# EAGLE schematic sensorBoard (EAGLE 9.4.2)
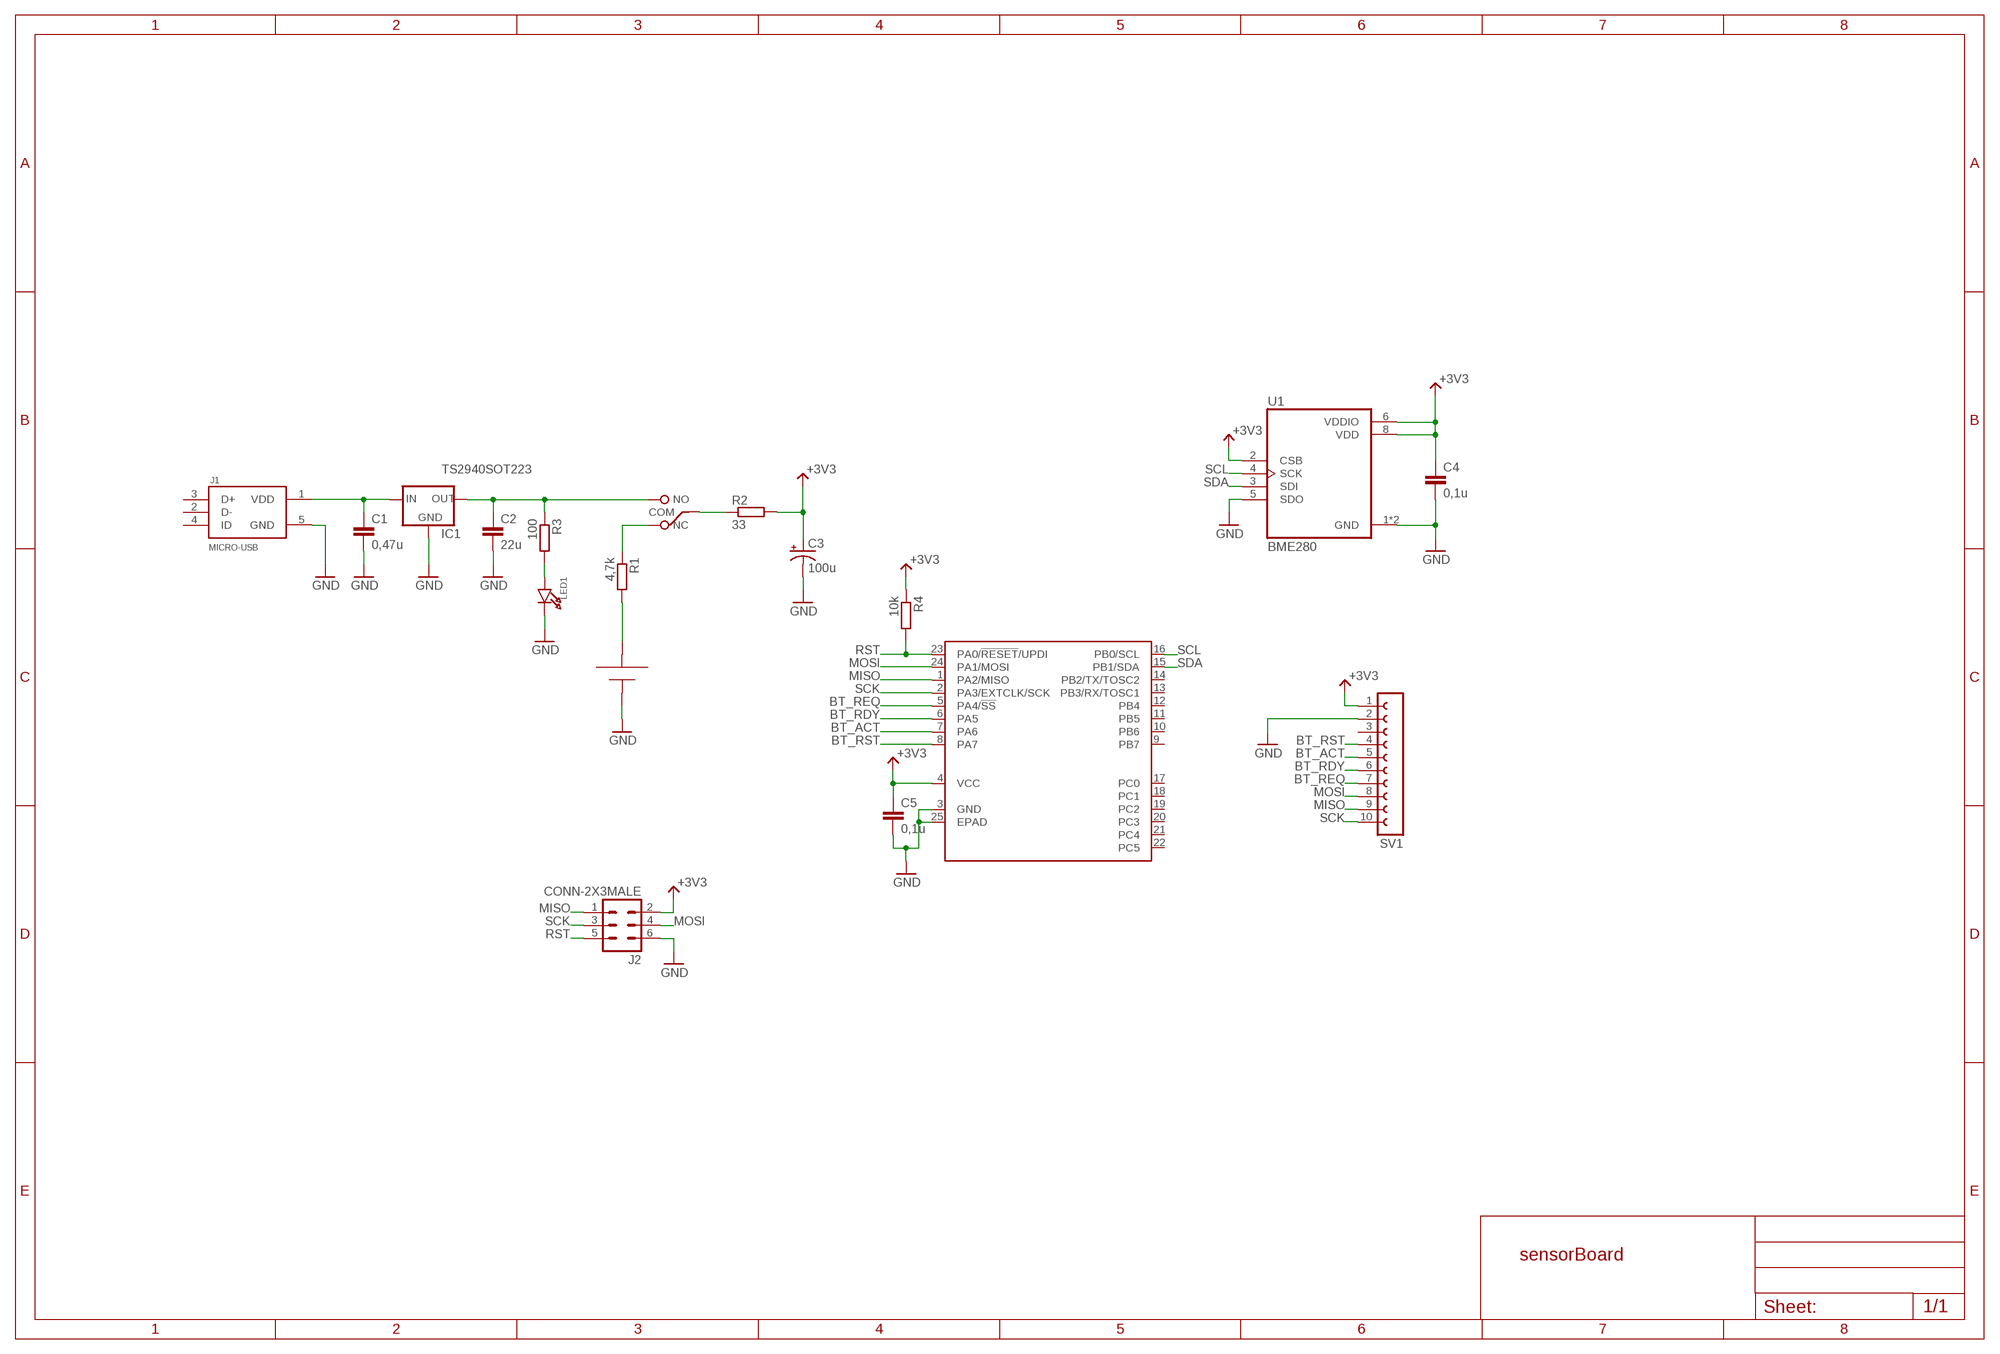
[diagram p0: schematic, sheet 1]

## Parts
C1  0,47u  SMD-CAPACITORC0805  [C0805K]
C2  22u  SMD-CAPACITORC0805  [C0805K]
C3  100u  SMD-ELECTROLYTIC-CAPACITORD8  [CAPAE660X800]
C4  0,1u  SMD-CAPACITORC0805  [C0805K]
C5  0,1u  SMD-CAPACITORC0805  [C0805K]
IC1  TS2940SOT223  [SOT230P700X180-4]
J1  MICRO-USB  [MOLEX_105017-0001]
J2  CONN-2X3MALE  [HDRV6W64P254_2X3_762X508X838B]
LED1  LED0805  [LED0805]
R1  4,7k  SMD-RESISTORR0805  [R0805]
R2  33  SMD-RESISTORR0805  [R0805]
R3  100  SMD-RESISTORR0805  [R0805]
R4  10k  SMD-RESISTORR0805  [R0805]
SV1  FE10-1  [FE10]
SW1  SWITCH  [EG1215AA]
U1  BME280  [PSON65P250X250X100-8N]
U$1  ATTINY3217TQFN-24  [QFN50P400X400X80-25T270]
U$3  CR24773039  [CR2477]

## Nets
+3V3: C3.1(+) C4.1 C5.1 J2.2 R2.2 R4.1 SV1.1 U1.2(CSB) U1.6(VDDIO) U1.8(VDD) U$1.4(VCC)
BT_ACT: SV1.5 U$1.7(PA6)
BT_RDY: SV1.6 U$1.6(PA5)
BT_REQ: SV1.7 U$1.5(PA4/!SS!)
BT_RST: SV1.4 U$1.8(PA7)
GND: C1.2 C2.2 C4.2 C5.2 IC1.2(GND) IC1.4(GND) J1.5(GND) J2.6 LED1.K(C) SV1.2 U1.1(GND) U1.5(SDO) U1.7(GND) U$1.3(GND) U$1.25(EPAD) U$3.P$3(N)
MISO: J2.1 SV1.9 U$1.1(PA2/MISO)
MOSI: J2.4 SV1.8 U$1.24(PA1/MOSI)
N$1: R1.1 SW1.1(NC)
N$2: C1.1 IC1.1(IN) J1.1(VDD)
N$3: C2.1 IC1.3(OUT) R3.1 SW1.3(NO)
N$4: R1.2 U$3.P$1(P) U$3.P$2(P)
N$5: R2.1 SW1.2(COM)
N$7: C3.2(-) ; supply symbol labelled GND
N$8: LED1.A R3.2
RST: J2.5 R4.2 U$1.23(PA0/!RESET!/UPDI)
SCK: J2.3 SV1.10 U$1.2(PA3/EXTCLK/SCK)
SCL: U1.4(SCK) U$1.16(PB0/SCL)
SDA: U1.3(SDI) U$1.15(PB1/SDA)
Unconnected: J1.2(D-) J1.3(D+) J1.4(ID) SV1.3 U$1.9(PB7) U$1.10(PB6) U$1.11(PB5) U$1.12(PB4) U$1.13(PB3/RX/TOSC1) U$1.14(PB2/TX/TOSC2) U$1.17(PC0) U$1.18(PC1) U$1.19(PC2) U$1.20(PC3) U$1.21(PC4) U$1.22(PC5)

## Library data of the parts
C1 C2 C4 C5 = PDI_PassiveComponents:SMD-CAPACITOR: SMD CAPACITORS: 0603, 0805, 1206
C3 = PDI_PassiveComponents:SMD-ELECTROLYTIC-CAPACITOR
IC1 = PDI_Semiconductors:TS2940
J1 = PDI_Connectors:MICRO-USB; AVAILABILITY: Available; DESCRIPTION: Conn USB Type B M 5 POS 0.65mm Solder RA Thru-Hole 5 Terminal 1 Port Embossed T/R; MF: Molex; MOUSER: https://www.mouser.fi/ProductDetail/538-105017-0001; MP: 105017-0001; PACKAGE: None; PRICE: 0,681
J2 = PDI_Connectors:CONN-2X3
LED1 = PDI_Semiconductors:LED: LED 0603 - 0603 Surface Mount Package 2mA: Green LED - Low Power (3.9mcd, 2ma, 1.7Vf) - Digikey: 475-2709-2-ND Orange LED - Low Power (9.8mcd, 2ma, 1.8Vf) - Digikey: 475-1194-2-ND Red LED - Low Power (5mcd, 2ma, 1.8Vf) - Digikey: 475-1195-2-ND Yellow LED - Low Power (7mcd, 2ma, 1.8Vf) - Digikey: 475-1196-2-ND 5mA: Blue LED - Low Power (17mcd, 5ma, 2.9Vf) - Digikey: LNJ937W8CRACT-ND 0805 - 0805 Surface Mount Package 2mA: Red LED (8.8mcd, 2mA, 1.8Vf, Clear) - Low Power [Digikey: 475-2510-1-ND] Green LED (5mcd, 2mA, 1.8Vf, Clear) - Low Power [Digikey: 475-2730-1-ND] Yellow LED (11.3mcd, 2mA, 1.8Vf, Clear) - Low Power [Digikey: 475-2555-1-ND] 20mA: Red LED (104mcd, 20mA, Diffused) - LS R976 [Digikey: 475-1278-6-ND] Red LED (12mcd, 20mA, 2.0Vf, Clear) - APT2012EC [Digikey: 754-1128-1-ND] Green LED (15mcd, 20mA, 2.2Vf, Clear) - APT2012GC [Digikey: 754-1131-1-ND] Orange LED (160mcd, 20mA, 2.1Vf, Clear) - APT2012SECK [Digikey: 754-1130-1-ND] 1206 - 1206 Surface Mount Package Green LED (26mcd, 20mA, Diffused) - LG N971 [Digikey: 475-1407-6-ND] Red LED (15mcd, 20mA, Diffused) - LH N974 [Digikey: 475-1416-6-ND]
R1-R4 = PDI_PassiveComponents:SMD-RESISTOR: SMD RESISTORS: 0603, 0805, 1206
SV1 = con-lsta:FE10-1: FEMALE HEADER; OC_FARNELL: unknown; OC_NEWARK: unknown
SW1 = PDI_MechanicalComponents:SWITCH
U1 = PDI_Semiconductors:BME280: DIGITAL HUMIDITY, PRESSURE AND TEMPERATURE SENSOR * Digital interface I²C (up to 3.4 MHz) and SPI (3 and 4 wire, up to 10 MHz)* Supply voltage VDD main supply voltage range: 1.71 V to 3.6 V*VDDIO interface voltage range: 1.2 V to 3.6 V Operating range -40…+85 °C, 0…100 % rel. humidity, 300…1100 hPa The library has been designed by Richard Magdycz <https://www.facebook.com/groups/eaglecadsoftUK>; AVAILABILITY: Unavailable; DESCRIPTION: Integrated pressure, humidity and temperature sensor; 8-pin 2.5x2.5x0.93mm LGA; MF: Bosch; MP: BME280; PACKAGE: LGA-8 Bosch; PRICE: None
U$1 = PDI_Semiconductors:ATTINY3217
U$3 = PDI_MechanicalComponents:CR2477